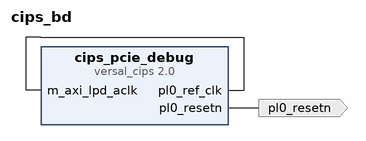
[diagram p0: block diagram of the top level]
# Vivado block design cips_bd, xcvm1802-vsva2197-2MP-e-S-es1, Vivado 2020.1
create_bd_design cips_bd

create_bd_port -dir O -type rst pl0_resetn

create_bd_cell -type ip -vlnv xilinx.com:ip:versal_cips:2.0 cips_pcie_debug
set_property -dict [list \
  CONFIG.PMC_CRP_PL0_REF_CTRL_FREQMHZ 100 \
  CONFIG.PMC_MIO_37_DIRECTION out \
  CONFIG.PMC_MIO_37_OUTPUT_DATA high \
  CONFIG.PMC_MIO_37_USAGE GPIO \
  CONFIG.PS_NUM_FABRIC_RESETS 1 \
  CONFIG.PS_PCIE_RESET_ENABLE 1 \
  CONFIG.PS_USE_M_AXI_GP2 1 \
  CONFIG.PS_USE_PMCPL_CLK0 1 \
] [get_bd_cells cips_pcie_debug]

# ---- connections ----

connect_bd_net [get_bd_pins cips_pcie_debug/pl0_ref_clk] [get_bd_pins cips_pcie_debug/m_axi_lpd_aclk]
connect_bd_net [get_bd_pins cips_pcie_debug/pl0_resetn] [get_bd_ports pl0_resetn]

validate_bd_design
save_bd_design
